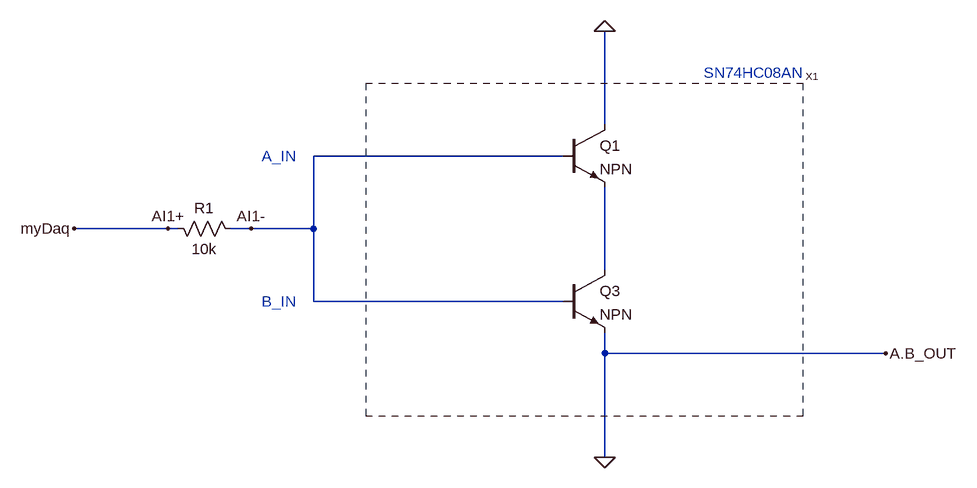
[diagram p0: schematic AND Gate with Diode and Resistor.asc]
AND Gate with Diode and Resistor.asc, the LTspice schematic file:
Version 4
SHEET 1 880 680
WIRE 112 -16 112 -160
WIRE 48 32 -336 32
WIRE -560 144 -704 144
WIRE -544 144 -560 144
WIRE -432 144 -464 144
WIRE -336 144 -336 32
WIRE -336 144 -432 144
WIRE 112 208 112 80
WIRE -336 256 -336 144
WIRE 48 256 -336 256
WIRE 112 336 112 304
WIRE 544 336 112 336
WIRE 112 496 112 336
FLAG 544 336 A.B_OUT
FLAG 112 496 0
FLAG -704 144 myDaq
FLAG -560 144 AI1+
FLAG -432 144 AI1-
FLAG 112 -160 0
SYMBOL npn 48 -16 R0
SYMATTR InstName Q1
SYMBOL npn 48 208 R0
SYMATTR InstName Q3
SYMBOL blackbox -256 432 R0
SYMATTR InstName X1
SYMBOL res -560 128 M90
WINDOW 0 0 56 VBottom 2
WINDOW 3 32 56 VTop 2
SYMATTR InstName R1
SYMATTR Value 10k
TEXT -416 32 Left 2 ;A_IN
TEXT -416 256 Left 2 ;B_IN
TEXT 264 -96 Left 2 ;SN74HC08AN

The netlist it stands for:
* AND Gate with Diode and Resistor.asc
Q1 0 AI1- N001 0 NPN
Q3 N001 AI1- 0 0 NPN
XX1 blackbox
R1 AI1+ AI1- 10k
.model NPN NPN
.model PNP PNP
.lib standard.bjt
* A_IN
* B_IN
* SN74HC08AN
.backanno
.end